# Altium schematic sheet thvd8000.SchDoc
size A4; SheetNumber: 4; SheetTotal: 4
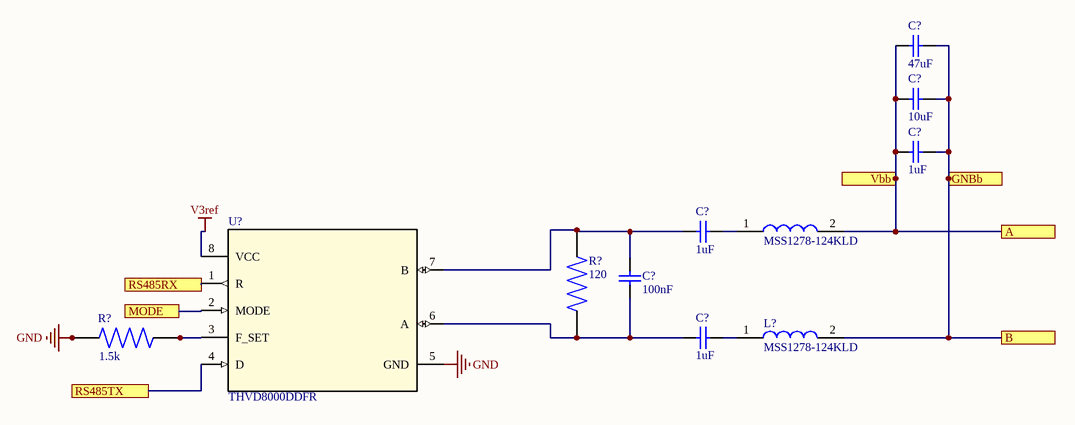
[diagram p0: thvd8000.SchDoc]

## Parts
(Parts that share a designator on the sheet are numbered #1, #2 ... from top to bottom, then left to right.)
C?#1  47uF  [CAPC3216X94X50ML20T25]
C?#2  10uF  [CAPC3216X94X50ML20T25]
C?#3  1uF  [CAPC3216X94X50ML20T25]
C?#4  1uF  [CAPC3216X94X50ML20T25]
C?#5  100nF  [CAPC3216X94X50ML20T25]
C?#6  1uF  [CAPC3216X94X50ML20T25]
L?  MSS1278-124KLD  [INDPM120120X805N]
R?#1  120  [RESC3116X75N]
R?#2  1.5k  [RESC3116X75N]
U?  THVD8000DDFR  [DDF0008A-IPC_A]
  MSS1278-124KLD  [INDPM120120X805N]

## Ports
A, B, GNBb, MODE, RS485RX, RS485TX, Vbb

## Nets
GND: R?#2.1 U?.5(GND)
V3ref: U?.8(VCC)
A: C?#1.1 C?#2.1 C?#3.1 .2 ; port Vbb, port A
B: C?#1.2 C?#2.2 C?#3.2 L?.2 ; port GNBb, port B
MODE: U?.2(MODE) ; port MODE
RS485RX: U?.1(R) ; port RS485RX
RS485TX: U?.4(D) ; port RS485TX
NetC?#4_1: C?#4.1 C?#5.1 R?#1.2 U?.7(B)
NetC?#4_2: C?#4.2 .1
NetC?#5_2: C?#5.2 C?#6.1 R?#1.1 U?.6(A)
NetC?#6_2: C?#6.2 L?.1
NetR?#2_2: R?#2.2 U?.3(F_SET)

## Library data of the parts
C?#1-C?#4 C?#6 = CMP-2000-05018-1: Chip Capacitor, Ceramic, 100 nF, 10%, 50 V, 1206, RoHS, Tape and Reel; Manufacturer: AVX; Rated Voltage: 50V; Dielectric: X7R; Capacitance: 100nF; Datasheet URL: http://www.mouser.com/ds/2/40/cauto-360.pdf; Manufacturer URL: http://www.avx.com/; Datasheet Version: Sep-14; Tolerance (%): ±10%; Case Size/Dimension: 1206
C?#5 = CMP-2000-05018-1: Chip Capacitor, Ceramic, 100 nF, 10%, 50 V, 1206, RoHS, Tape and Reel; Manufacturer: AVX; Rated Voltage: 50V; Dielectric: X7R; Datasheet URL: http://www.mouser.com/ds/2/40/cauto-360.pdf; Capacitance: 100nF; Manufacturer URL: http://www.avx.com/; Datasheet Version: Sep-14; Tolerance (%): ±10%; Case Size/Dimension: 1206
L?  = MSS1278-124KLD: Inductor; Manufacturer_Name: COILCRAFT; Datasheet Link: https://componentsearchengine.com/Datasheets/1/MSS1278-124KLD.pdf; Height: 8.05mm; Manufacturer_Part_Number: MSS1278-124KLD
R?#1 R?#2 = RTAN1206BKE33R0: MF: {'manufacturer': u'Stackpole Electronics Inc'}; Value: *; Package: None; MP: RTAN1206BKE33R0; Price: None; Availability: Unavailable
U? = THVD8000DDFR: No Description Available; Mfr_Name: Texas Instruments; Type: DEV; RefDes: RefDes; Copyright: Copyright (C) 2021 Ultra Librarian. All rights reserved.; Manufacturer_Part_Number: THVD8000DDFR